# EAGLE design NRF24l01 Breakout (EAGLE 6.4)
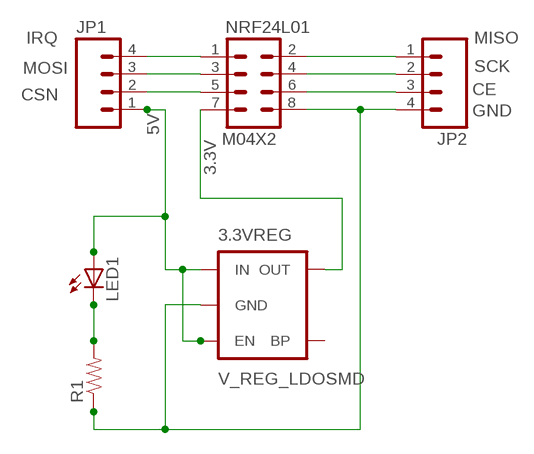
[diagram p0: schematic, sheet 1]

## Parts
3.3VREG  V_REG_LDOSMD  [SOT23-5]
JP1  M04LOCK  [1X04_LOCK]
JP2  M04LOCK  [1X04_LOCK]
LED1  LED0603  [LED-0603]
NRF24L01  M04X2  [2X4]
R1  RESISTOR0805-RES  [0805]

## Nets
3.3V: 3.3VREG.5(OUT) NRF24L01.7
5V: 3.3VREG.1(IN) 3.3VREG.3(EN) JP1.1 LED1.A
CE: JP2.3 NRF24L01.6
CSN: JP1.2 NRF24L01.5
GND: 3.3VREG.2(GND) JP2.4 NRF24L01.8 R1.1
IRQ: JP1.4 NRF24L01.1
MISO: JP2.1 NRF24L01.2
MOSI: JP1.3 NRF24L01.3
N$1: LED1.C R1.2
SCK: JP2.2 NRF24L01.4
Unconnected: 3.3VREG.4(BP)

## Library data of the parts
3.3VREG = SparkFun:V_REG_LDO: Voltage Regulator LDO Standard 150mA LDO voltage regulator in SOT-23 layout. Micrel part MIC5205. BP (by-pass) pin is used to lower output noise with 470pF cap.
JP1 JP2 = SparkFun:M04: Header 4 Standard 4-pin 0.1" header. Use with straight break away headers (SKU : PRT-00116), right angle break away headers (PRT-00553), swiss pins (PRT-00743), machine pins (PRT-00117), and female headers (PRT-00115). Molex polarized connector foot print use with SKU : PRT-08231 with associated crimp pins and housings. 1MM SMD Version SKU: PRT-10208
LED1 = SparkFun:LED: LEDs Standard schematic elements and footprints for 5mm, 3mm, 1206, and 0603 sized LEDs. 5mm - Spark Fun Electronics SKU : COM-00529 (and others)
NRF24L01 = SparkFun:M04X2
R1 = SparkFun:RESISTOR: Resistor Basic schematic elements and footprints for 0603, 1206, and PTH resistors.

## Board
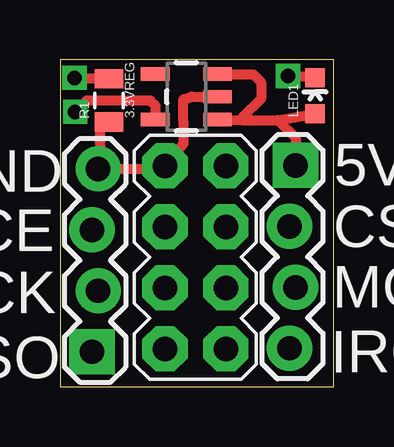
[diagram p1: board, top side]
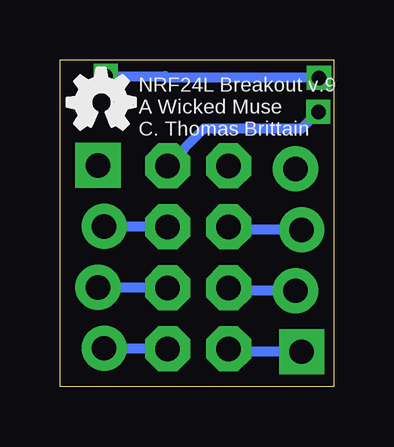
[diagram p2: board, bottom side, seen from below]

Size 11.4 x 13.62 mm. Coordinates in mm from the lower left corner, seen from the top.
Outline: 0,0 11.4,0 11.4,13.62 0,13.62 0,0
Copper layers (1*16): Top 0.035mm / dielectric 1.5mm / Bottom 0.035mm
Design rules "default": minimum track width 10mil, minimum drill 24mil, track to track 8mil, track to pad 8mil, pad to pad 8mil, via to via 8mil, smd to smd 8mil, copper to edge 40mil, drill to drill 8mil, minimum pad ring 10mil, minimum via ring 8mil, stop-mask expansion 4mil, vias tented up to drill 0mil, thermal gap 10mil

### Footprints (pad centres in the part's own frame; a part is rotated, then mirrored left to right if it is on the bottom)
SOT23-5 = smd 0.55 x 1.2: 1 -0.95,-1.3; 2 0,-1.3; 3 0.95,-1.3; 4 0.95,1.3; 5 -0.95,1.3
1X04_LOCK = drill 1.016 pad 1.88 square: 1 0,0.127 | drill 1.016 pad 1.88: 2 2.54,-0.127; 3 5.08,0.127; 4 7.62,-0.127
LED-0603 = smd 0.8 x 0.8: A 0,-0.75; C 0,0.75
2X4 = drill 1.016 pad 1.88 octagon: 1 -3.81,-1.27; 2 -3.81,1.27; 3 -1.27,-1.27; 4 -1.27,1.27; 5 1.27,-1.27; 6 1.27,1.27; 7 3.81,-1.27; 8 3.81,1.27
0805 = smd 0.8 x 1.2: 1 -0.9,0; 2 0.9,0

### Placement (x,y rotation side)
3.3VREG  5.27,12.08 90 top
JP1  9.69,9.22 270 top
JP2  1.46,1.46 90 top
LED1  10.63,12.12 0 top
NRF24L01  5.64,5.39 90 top
R1  2.04,11.94 90 top
U$1  [OSHW_FILLX100_NOTEXT]  11.09,10.73 0 bottom

### Tracks (layer width: path | path; a pad name or v marks a point on that pad's centre or on a via)
3.3V  (via drill 0.6)
  Top 0.406: 3.3VREG.5 3.98,11.71 3.77,11.93 1.11,11.93 0.64,11.46 v0.63,11.46
  Bottom 0.406: NRF24L01.7 6.91,9.23 5.38,10.77 1.32,10.77 v0.63,11.46
5V
  Top 0.406: 9.07,11.12 LED1.A | 7.6,11.1 3.3VREG.1 7.89,11.12 | 7.6,11.1 7.95,11.09 7.97,11.12 9.07,11.12 | 3.3VREG.3 6.59,12.96 6.64,13.01 8.06,13.01 8.38,12.7 8.38,12 7.6,11.22 7.6,11.1 | 9.07,11.12 9.81,10.37 JP1.1
CE
  Bottom 0.406: JP2.3 4.25,6.54 NRF24L01.6
CSN
  Bottom 0.406: JP1.2 6.93,6.68 NRF24L01.5
GND
  Top 0.406: R1.1 1.64,11.05 1.67,9.76 1.42,9.24 JP2.4 4.25,9.08 NRF24L01.8 4.39,9.2 5.15,10.14 5.14,11.97 5.49,12.09 6.54,12.09 3.3VREG.2
IRQ
  Bottom 0.406: JP1.4 6.93,1.6 NRF24L01.1
MISO
  Bottom 0.406: JP2.1 4.25,1.46 NRF24L01.2
MOSI
  Bottom 0.406: JP1.3 6.93,4.14 NRF24L01.3
N$1  (via drill 0.6)
  Top 0.406: R1.2 1,12.85 v0.61,12.87 | LED1.C 9.63,12.96 v9.5,12.95
  Bottom 0.406: v0.61,12.87 1.06,12.9 6.99,12.9 7.03,12.95 v9.5,12.95
SCK
  Bottom 0.406: JP2.2 4.25,4 NRF24L01.4

### Text on the board
_tsilk: GND | 5V | CE | CSN | SCK | MOSI | IRQ | MISO
_bsilk: NRF24L Breakout v.9 / A Wicked Muse / C. Thomas Brittain